# EAGLE design psvsd-v21 (EAGLE 8.2.0)

## Sheet 1 of 2: Connections
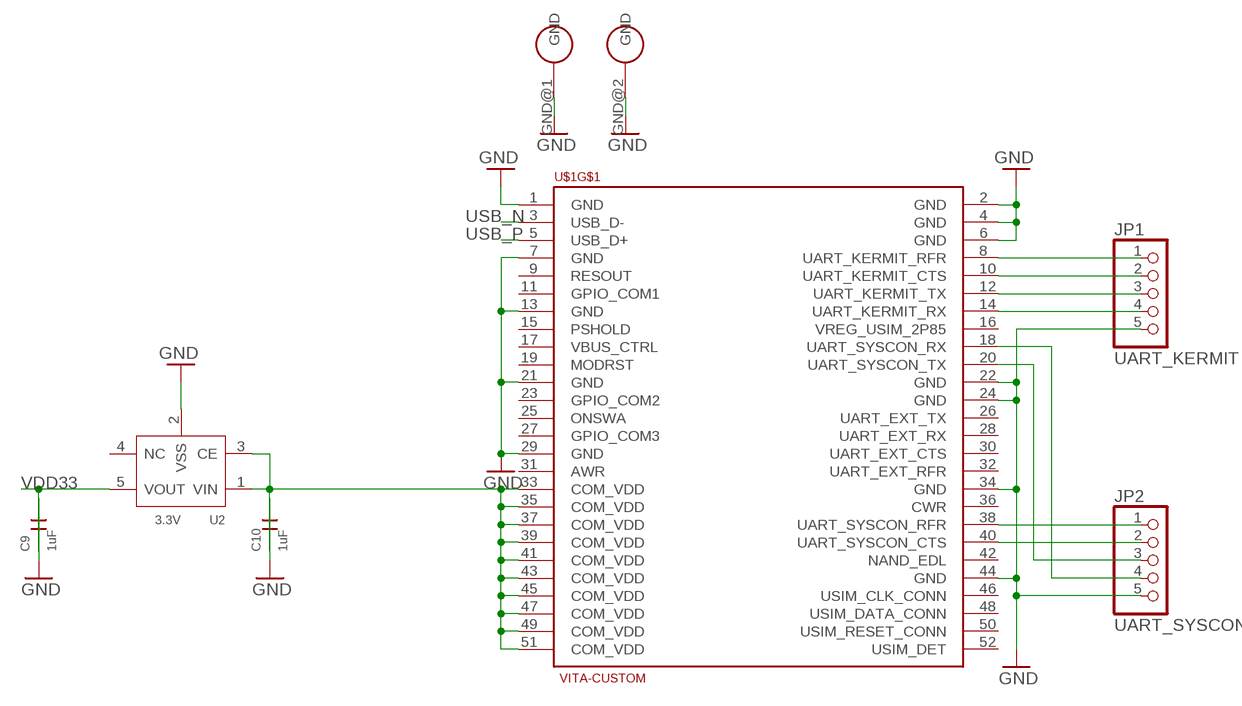
[diagram p0: schematic, sheet 1]

### Parts
C9  1uF  CERAMIC-1NF-50V-5%-C0G(0603)  [C0603]
C10  1uF  CERAMIC-1NF-50V-5%-C0G(0603)  [C0603]
JP1  UART_KERMIT  PINHD-1X5  [1X05]
JP2  UART_SYSCON  PINHD-1X5  [1X05]
U2  3.3V  PMIC-LDO-XC6204B332MR(SOT23-5)  [SOT-23-5]
U$1  VITA-CUSTOM  [VITA-MINI-PCI-E]

### Nets
GND [GND]: C9.2 C10.2 JP1.5 JP2.5 U2.2(VSS) U$1.1(GND) U$1.2(GND) U$1.4(GND) U$1.6(GND) U$1.7(GND) U$1.13(GND) U$1.21(GND) U$1.22(GND) U$1.24(GND) U$1.29(GND) U$1.34(GND) U$1.44(GND) U$1.GND@1(GND) U$1.GND@2(GND) ; also sheet 2
UART_KERMIT_CTS: JP1.2 U$1.10(UART_KERMIT_CTS)
UART_KERMIT_RFR: JP1.1 U$1.8(UART_KERMIT_RFR)
UART_KERMIT_RX: JP1.4 U$1.14(UART_KERMIT_RX)
UART_KERMIT_TX: JP1.3 U$1.12(UART_KERMIT_TX)
UART_SYSCON_CTS: JP2.2 U$1.40(UART_SYSCON_CTS)
UART_SYSCON_RFR: JP2.1 U$1.38(UART_SYSCON_RFR)
UART_SYSCON_RX: JP2.4 U$1.18(UART_SYSCON_RX)
UART_SYSCON_TX: JP2.3 U$1.20(UART_SYSCON_TX)
USB_N [USB]: U$1.3(USB_D-) ; also sheet 2
USB_P [USB]: U$1.5(USB_D+) ; also sheet 2
VDD [Power]: C10.1 U2.1(VIN) U2.3(CE) U$1.33(COM_VDD) U$1.35(COM_VDD) U$1.37(COM_VDD) U$1.39(COM_VDD) U$1.41(COM_VDD) U$1.43(COM_VDD) U$1.45(COM_VDD) U$1.47(COM_VDD) U$1.49(COM_VDD) U$1.51(COM_VDD)
VDD33: C9.1 U2.5(VOUT) ; also sheet 2
Unconnected: U2.4(NC) U$1.9(RESOUT) U$1.11(GPIO_COM1) U$1.15(PSHOLD) U$1.16(VREG_USIM_2P85) U$1.17(VBUS_CTRL) U$1.19(MODRST) U$1.23(GPIO_COM2) U$1.25(ONSWA) U$1.26(UART_EXT_TX) U$1.27(GPIO_COM3) U$1.28(UART_EXT_RX) U$1.30(UART_EXT_CTS) U$1.31(AWR) U$1.32(UART_EXT_RFR) U$1.36(CWR) U$1.42(NAND_EDL) U$1.46(USIM_CLK_CONN) U$1.48(USIM_DATA_CONN) U$1.50(USIM_RESET_CONN) U$1.52(USIM_DET)

## Sheet 2 of 2: USB to SD
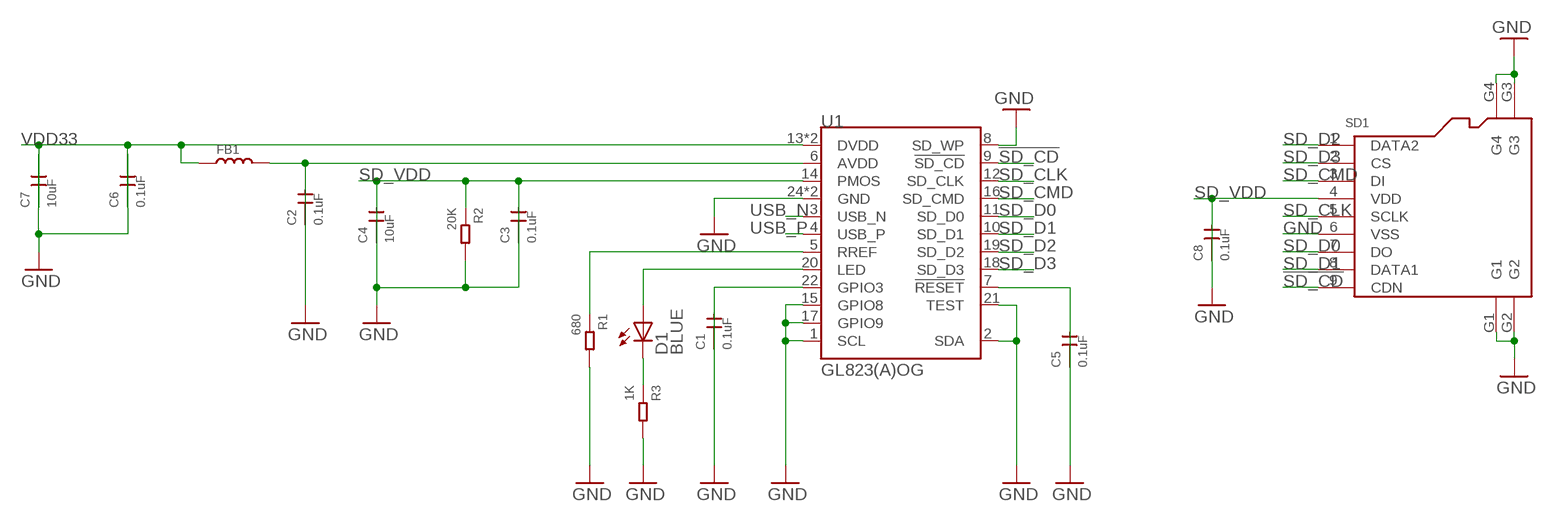
[diagram p1: schematic, sheet 2]

### Parts
C1  0.1uF  CERAMIC-1NF-50V-5%-C0G(0603)  [C0603]
C2  0.1uF  CERAMIC-1NF-50V-5%-C0G(0603)  [C0603]
C3  0.1uF  CERAMIC-1NF-50V-5%-C0G(0603)  [C0603]
C4  10uF  CERAMIC-1NF-50V-5%-C0G(0603)  [C0603]
C5  0.1uF  CERAMIC-1NF-50V-5%-C0G(0603)  [C0603]
C6  0.1uF  CERAMIC-1NF-50V-5%-C0G(0603)  [C0603]
C7  10uF  CERAMIC-1NF-50V-5%-C0G(0603)  [C0603]
C8  0.1uF  CERAMIC-1NF-50V-5%-C0G(0603)  [C0603]
D1  BLUE  LEDCHIP-LED0603  [CHIP-LED0603]
FB1  SMD-FERRITE-BEAD-2500R-50MA(0603)  [L0603]
R1  680  SMD-RES-0R-5%-1/10W(0603)  [R0603]
R2  20K  SMD-RES-0R-5%-1/10W(0603)  [R0603]
R3  1K  SMD-RES-0R-5%-1/10W(0603)  [R0603]
SD1  MICRO-SD-CARD-SOCKET-9P(ST-TF-003A)  [MICRO-SD9+4P-SMD-16.1X14.5X1.85MM]
U1  GL823(A)OG  [QFN-24]

### Nets
!RESET: C5.1 U1.7(!RESET)
!SD_CD: SD1.9(CDN) U1.9(!SD_CD)
AVDD33: C2.1 FB1.2 U1.6(AVDD)
GND [GND]: C1.2 C2.2 C3.2 C4.2 C5.2 C6.2 C7.2 C8.2 R1.2 R2.2 R3.2 SD1.6(VSS) SD1.G1 SD1.G2 SD1.G3 SD1.G4 U1.1(SCL) U1.2(SDA) U1.8(SD_WP) U1.15(GPIO8) U1.17(GPIO9) U1.21(TEST) U1.24(GND) U1.25(GND) ; also sheet 1
GPIO3: C1.1 U1.22(GPIO3)
LED [GND]: D1.A U1.20(LED)
LED_N [GND]: D1.C R3.1
RREF: R1.1 U1.5(RREF)
SD_CLK [Clock/HS]: SD1.5(SCLK) U1.12(SD_CLK)
SD_CMD: SD1.3(DI) U1.16(SD_CMD)
SD_D0 [Clock/HS]: SD1.7(DO) U1.11(SD_D0)
SD_D1 [Clock/HS]: SD1.8(DATA1) U1.10(SD_D1)
SD_D2 [Clock/HS]: SD1.1(DATA2) U1.19(SD_D2)
SD_D3 [Clock/HS]: SD1.2(CS) U1.18(SD_D3)
SD_VDD: C3.1 C4.1 C8.1 R2.1 SD1.4(VDD) U1.14(PMOS)
USB_N [USB]: U1.3(USB_N) ; also sheet 1
USB_P [USB]: U1.4(USB_P) ; also sheet 1
VDD33: C6.1 C7.1 FB1.1 U1.13(DVDD) U1.23(DVDD) ; also sheet 1

## Library data of the parts
C1-C10 = Seeed-Capacitor:CERAMIC-1NF-50V-5%-C0G(0603): 302010341; MPN: GRM1885C1H102JA01D; VALUE: 1nf
D1 = led:LED: LED OSRAM: - CHIPLED LG R971, LG N971, LY N971, LG Q971, LY Q971, LO R971, LY R971 LH N974, LH R974 LS Q976, LO Q976, LY Q976 LO Q996 - Hyper CHIPLED LW Q18S LB Q993, LB Q99A, LB R99A - SideLED LS A670, LO A670, LY A670, LG A670, LP A670 LB A673, LV A673, LT A673, LW A673 LH A674 LY A675 LS A676, LA A676, LO A676, LY A676, LW A676 LS A679, LY A679, LG A679 - Hyper Micro SIDELED® LS Y876, LA Y876, LO Y876, LY Y876 LT Y87S - SmartLED LW L88C, LW L88S LB L89C, LB L89S, LG L890 LS L89K, LO L89K, LY L89K LS L896, LA L896, LO L896, LY L896 - TOPLED LS T670, LO T670, LY T670, LG T670, LP T670 LSG T670, LSP T670, LSY T670, LOP T670, LYG T670 LG T671, LOG T671, LSG T671 LB T673, LV T673, LT T673, LW T673 LH T674 LS T676, LA T676, LO T676, LY T676, LB T676, LH T676, LSB T676, LW T676 LB T67C, LV T67C, LT T67C, LS T67K, LO T67K, LY T67K, LW E67C LS E67B, LA E67B, LO E67B, LY E67B, LB E67C, LV E67C, LT E67C LW T67C LS T679, LY T679, LG T679 LS T770, LO T770, LY T770, LG T770, LP T770 LB T773, LV T773, LT T773, LW T773 LH T774 LS E675, LA E675, LY E675, LS T675 LS T776, LA T776, LO T776, LY T776, LB T776 LHGB T686 LT T68C, LB T68C - Hyper Mini TOPLED® LB M676 - Mini TOPLED Santana® LG M470 LS M47K, LO M47K, LY M47K Source: http://www.osram.convergy.de LUXEON: - LUMILED® LXK2-PW12-R00, LXK2-PW12-S00, LXK2-PW14-U00, LXK2-PW14-V00 LXK2-PM12-R00, LXK2-PM12-S00, LXK2-PM14-U00 LXK2-PE12-Q00, LXK2-PE12-R00, LXK2-PE12-S00, LXK2-PE14-T00, LXK2-PE14-U00 LXK2-PB12-K00, LXK2-PB12-L00, LXK2-PB12-M00, LXK2-PB14-N00, LXK2-PB14-P00, LXK2-PB14-Q00 LXK2-PR12-L00, LXK2-PR12-M00, LXK2-PR14-Q00, LXK2-PR14-R00 LXK2-PD12-Q00, LXK2-PD12-R00, LXK2-PD12-S00 LXK2-PH12-R00, LXK2-PH12-S00 LXK2-PL12-P00, LXK2-PL12-Q00, LXK2-PL12-R00 Source: www.luxeon.com KINGBRIGHT: KA-3528ASYC Source: www.kingbright.com
FB1 = Seeed-Inductor:SMD-FERRITE-BEAD-2500R-50MA(0603): 303030020; VALUE: 2500R-50MA
JP1 JP2 = pinhead:PINHD-1X5: PIN HEADER
R1-R3 = Seeed-Resistor:SMD-RES-0R-5%-1/10W(0603): 301010292; MPN: RC0603JR-070RL; VALUE: 0R
SD1 = Seeed-Connector:MICRO-SD-CARD-SOCKET-9P(ST-TF-003A): 320090000; MPN: ST-TF-003A; VALUE: ST-TF-003A
U1 = GL823:GL823(A): USB 2.0 SD/MMC Card Reader Controller (3.3V)
U2 = Seeed-IC:PMIC-LDO-XC6204B332MR(SOT23-5): 310030046; MPN: XC6204B332MR; VALUE: XC6204B332MR-SOT23-5
U$1 = mini-pci-e:VITA-CUSTOM: Vita specific half Mini PCI Express module.

## Net classes
0 Digital: width 0.305 mm
2 Clock/HS: width 0.305 mm
3 Power: width 0.61 mm
4 USB: width 0.305 mm, clearance 0.508 mm to class 0, clearance 0.508 mm to class 1, clearance 1.27 mm to class 2, clearance 0.508 mm to class 3

## Board
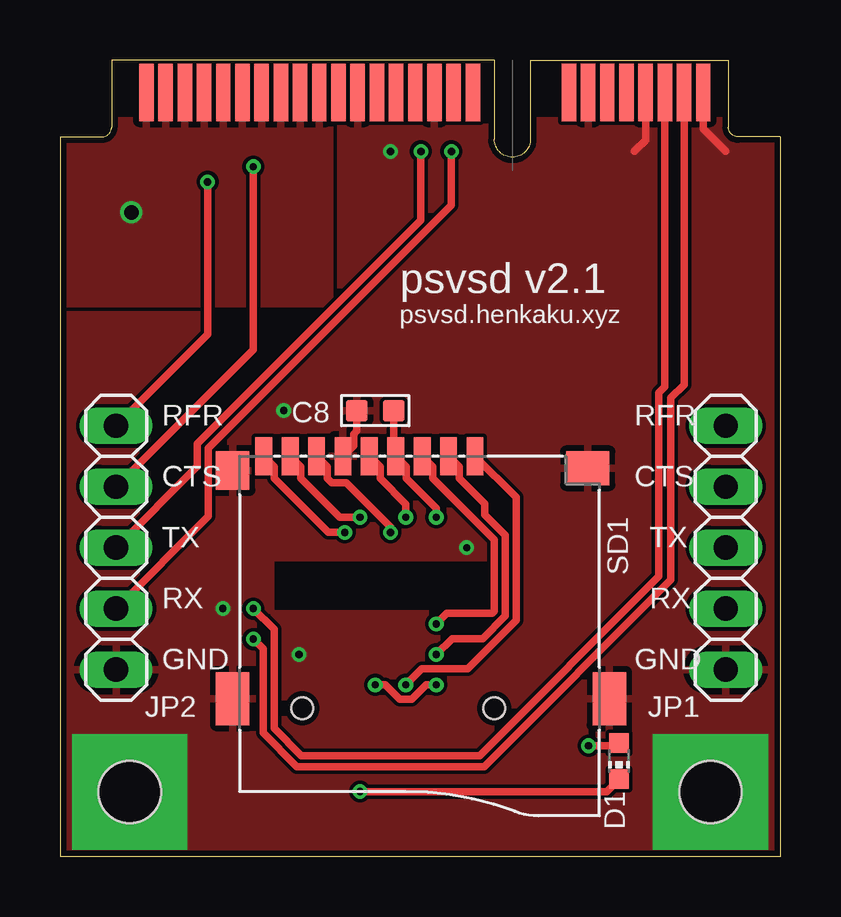
[diagram p2: board, top side]
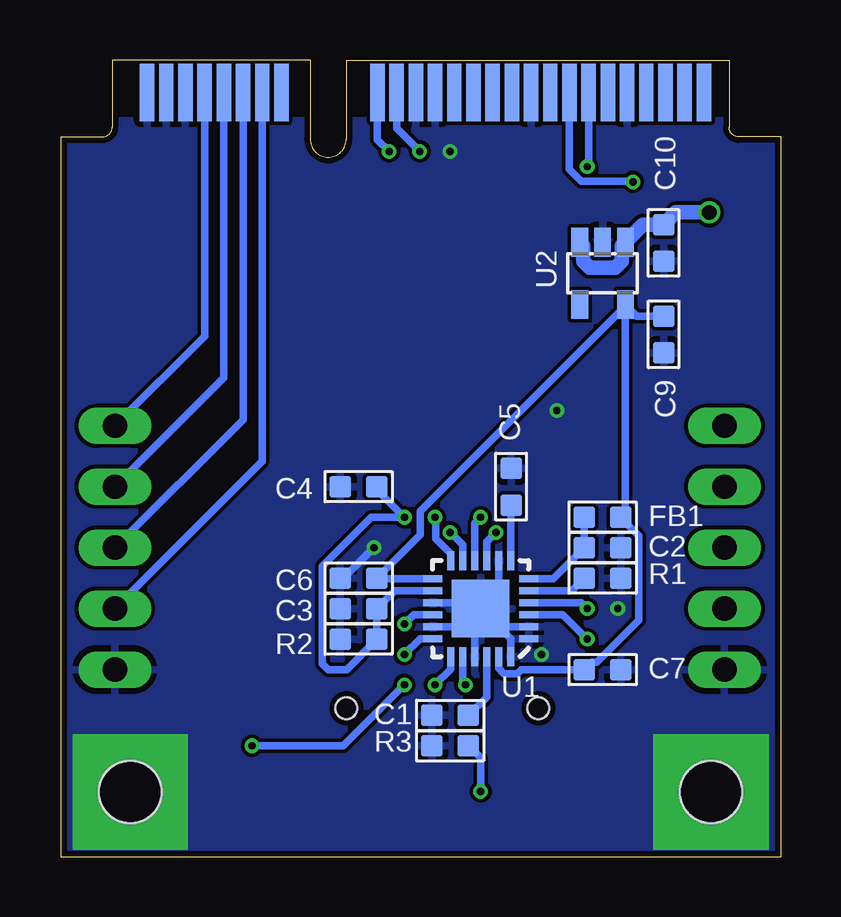
[diagram p3: board, bottom side, seen from below]

Size 30 x 33.2 mm. Coordinates in mm from the lower left corner, seen from the top.
Copper layers (1*16): Top 0.035mm / dielectric 1.5mm / Bottom 0.035mm
Design rules "SeeedStudio_2layer_DRU_no_angle_20140221": minimum track width 6mil, minimum drill 12mil, track to track 6mil, track to pad 6mil, pad to pad 6mil, via to via 6mil, smd to smd 0mil, copper to edge 10mil, drill to drill 10mil, minimum pad ring 10mil, minimum via ring 6mil, stop-mask expansion 2mil, vias tented up to drill 100mil, thermal gap 10mil

### Footprints (pad centres in the part's own frame; a part is rotated, then mirrored left to right if it is on the bottom)
C0603 = smd 0.889 x 0.889: 1 0,0.762; 2 0,-0.762
CHIP-LED0603 = smd 0.8 x 0.8: A 0,-0.75; C 0,0.75
L0603 = smd 0.889 x 0.889: 1 -0.762,0; 2 0.762,0
1X05 = drill 1.016 long: 1 -5.08,0; 2 -2.54,0; 3 0,0; 4 2.54,0; 5 5.08,0
R0603 = smd 0.889 x 0.889: 1 0,0.762; 2 0,-0.762
MICRO-SD9+4P-SMD-16.1X14.5X1.85MM = smd 1.6 x 0.7: 1 0,2.25; 2 0,1.15; 3 0,0.05; 4 0,-1.05; 5 0,-2.15; 6 0,-3.25; 7 0,-4.35; 8 0,-5.45; 9 0,-6.55 | smd 1.6 x 1.4: G1 0.6,-7.85 | smd 2.2 x 1.4: G2 10.1,-7.85; G3 10.1,7.85 | smd 1.4 x 1.8: G4 0.5,6.95 | hole 0.9: 10.5,-4.95; 10.5,3.05
QFN-24 = smd 0.8 x 0.3: 1 -2,1.25; 2 -2,0.75; 3 -2,0.25; 4 -2,-0.25; 5 -2,-0.75; 6 -2,-1.25; 13 2,-1.25; 14 2,-0.75; 15 2,-0.25; 16 2,0.25; 17 2,0.75; 18 2,1.25 | smd 0.3 x 0.8: 7 -1.25,-2; 8 -0.75,-2; 9 -0.25,-2; 10 0.25,-2; 11 0.75,-2; 12 1.25,-2; 19 1.25,2; 20 0.75,2; 21 0.25,2; 22 -0.25,2; 23 -0.75,2; 24 -1.25,2 | smd 2.4 x 2.4: 25 0,0
SOT-23-5 = smd 0.69 x 1.2: 1 -0.95,-1.3; 2 0,-1.3; 3 0.95,-1.3; 4 0.95,1.3; 5 -0.95,1.3
VITA-MINI-PCI-E = smd 0.6 x 2.4: 1 -7.95,1.35; 3 -7.15,1.35; 5 -6.35,1.35; 7 -5.55,1.35; 9 -4.75,1.35; 11 -3.95,1.35; 13 -3.15,1.35; 15 -2.35,1.35; 17 1.65,1.35; 19 2.45,1.35; 21 3.25,1.35; 23 4.05,1.35; 25 4.85,1.35; 27 5.65,1.35; 29 6.45,1.35; 31 7.25,1.35; 33 8.05,1.35; 35 8.85,1.35; 37 9.65,1.35; 39 10.45,1.35; 41 11.25,1.35; 43 12.05,1.35; 45 12.85,1.35; 47 13.65,1.35; 49 14.45,1.35; 51 15.25,1.35 | smd 0.6 x 2.4 bottom: 2 -7.55,1.35; 4 -6.75,1.35; 6 -5.95,1.35; 8 -5.15,1.35; 10 -4.35,1.35; 12 -3.55,1.35; 14 -2.75,1.35; 16 -1.95,1.35; 18 2.05,1.35; 20 2.85,1.35; 22 3.65,1.35; 24 4.45,1.35; 26 5.25,1.35; 28 6.05,1.35; 30 6.85,1.35; 32 7.65,1.35; 34 8.45,1.35; 36 9.25,1.35; 38 10.05,1.35; 40 10.85,1.35; 42 11.65,1.35; 44 12.45,1.35; 46 13.25,1.35; 48 14.05,1.35; 50 14.85,1.35; 52 15.65,1.35 | drill 2.6 pad 4.8 square: GND@1 -8.25,30.5; GND@2 15.95,30.5 | hole 2.6: -8.25,30.5; 15.95,30.5

### Placement (x,y rotation side)
C1  13.77,5.9 270 bottom
C2  7.42,12.88 90 bottom
C3  17.58,10.34 270 bottom
C4  17.58,15.42 270 bottom
C5  11.23,15.42 180 bottom
C6  17.58,11.61 270 bottom
C7  7.42,7.8 90 bottom
C8  13.14,18.6 270 top
C9  4.88,21.77 0 bottom
C10  4.88,25.58 0 bottom
D1  23.3,3.99 180 top
FB1  7.42,14.15 180 bottom
JP1  27.74,12.88 270 top
JP2  2.34,12.88 270 top
R1  7.42,11.61 90 bottom
R2  17.58,9.07 270 bottom
R3  13.77,4.63 270 bottom
SD1  15.04,16.69 270 top
U1  12.5,10.34 180 bottom
U2  7.42,24.31 180 bottom
U$1  18.85,33.2 180 top

### Tracks (layer width: path | path; a pad name or v marks a point on that pad's centre or on a via)
!RESET
  Bottom 0.305: U1.7 11.25,14.64 C5.1
!SD_CD  (via drill 0.3)
  Top 0.305: SD1.9 8.94,16.25 8.94,15.76 11.18,13.52 v11.87,13.52
  Bottom 0.305: U1.9 12.25,13.13 v11.87,13.52
AVDD33
  Bottom 0.305: U1.6 9.47,11.59 C2.1 FB1.2
GND  (via drill 0.3)
  Top 0.305: SD1.6 12.24,17.14 12.24,17.62 12.37,17.75 C8.2 | U$1.7 24.4,29.86 23.93,29.39 | U$1.1 26.8,30.33 27.74,29.39
  Bottom 0.305: U1.8 11.75,11.09 U1.25 | U1.15 12.75,10.59 U1.25 | U1.17 13.25,9.59 13.14,9.71 | 13.14,9.71 U1.25 | U1.21 12.75,9.32 13.14,9.71 | U1.2 11.75,9.59 U1.25 | U1.24 11.25,9.09 U1.25 | C6.2 18.21,11.61 v16.95,12.88
  other vias: 9.96,8.44 6.79,10.34 9.33,18.6 13.77,29.39
  pour Top (rank 3): -0.2,30.66 30.28,30.66 30.28,-1.09 -0.2,-1.09
  pour Bottom (rank 3): -0.2,30.66 30.28,30.66 30.28,-1.09 -0.2,-1.09
GPIO3
  Bottom 0.305: U1.22 12.25,6.65 C1.1
LED  (via drill 0.3)
  Top 0.305: v13.14,7.17 13.54,7.17 14.15,6.56 14.66,6.56 15.27,7.17 v15.68,7.17 | v22.03,4.63 23.18,4.63 D1.A
  Bottom 0.305: U1.20 13.25,7.28 v13.14,7.17 | v15.68,7.17 18.21,4.63 v22.03,4.63
LED_N  (via drill 0.3)
  Top 0.305: v12.5,2.72 22.78,2.72 D1.C
  Bottom 0.305: v12.5,2.72 12.5,4.12 R3.1
RREF
  Bottom 0.305: U1.5 8.7,11.09 R1.1
SD_CLK  (via drill 0.3)
  Top 0.305: SD1.5 13.34,16.25 13.34,15.76 14.41,14.69 v14.41,14.15
  Bottom 0.305: v14.41,14.15 14.38,14.13 14.38,13.26 13.75,12.63 U1.12
SD_CMD  (via drill 0.3)
  Top 0.305: SD1.3 15.54,16.25 15.54,15.76 18.09,13.21 18.09,10.23 18,10.14 16.11,10.14 v15.68,9.71
  Bottom 0.305: U1.16 15.29,10.09 v15.68,9.71
SD_D0  (via drill 0.3)
  Top 0.305: SD1.7 11.14,16.25 11.14,15.76 11.31,15.59 11.93,15.59 13.77,13.74 v13.77,13.52
  Bottom 0.305: U1.11 13.25,13 v13.77,13.52
SD_D1  (via drill 0.3)
  Top 0.305: SD1.8 10.04,16.25 10.04,15.76 11.65,14.15 v12.5,14.15
  Bottom 0.305: U1.10 12.75,13.9 v12.5,14.15
SD_D2  (via drill 0.3)
  Top 0.305: v14.41,7.17 15.07,7.83 16.98,7.83 19.01,9.85 19.01,13.21 | 19.01,13.21 | 19.01,13.21 19.01,14.97 SD1.1
  Bottom 0.305: U1.19 13.75,7.82 v14.41,7.17
SD_D3  (via drill 0.3)
  Top 0.305: v15.68,8.44 16.34,9.1 17.61,9.1 18.55,10.04 18.55,13.4 17.69,14.26 17.69,14.71 16.64,15.76 16.64,16.25 SD1.2
  Bottom 0.305: U1.18 15.02,9.09 v15.68,8.44
SD_VDD  (via drill 0.3)
  Top 0.305: v15.68,14.15 15.68,14.52 14.44,15.76 14.44,16.25 SD1.4 13.9,16.78 C8.1
  Bottom 0.305: U1.14 16.07,11.09 C3.1 R2.1 18.09,7.8 18.85,7.8 19.09,8.04 19.09,12.12 17.06,14.15 v15.68,14.15 16.82,15.29 C4.1
UART_KERMIT_CTS
  Bottom 0.305: JP1.2 23.2,19.96 U$1.10
UART_KERMIT_RFR
  Bottom 0.305: JP1.1 24,21.7 U$1.8
UART_KERMIT_RX
  Bottom 0.305: JP1.4 21.6,16.48 U$1.14
UART_KERMIT_TX
  Bottom 0.305: JP1.3 22.4,18.22 U$1.12
UART_SYSCON_CTS  (via drill 0.3)
  Top 0.305: JP2.2 8.06,21.14 v8.06,28.76
  Bottom 0.305: v8.06,28.76 8,28.81 U$1.40
UART_SYSCON_RFR  (via drill 0.3)
  Top 0.305: JP2.1 6.15,21.77 v6.15,28.12
  Bottom 0.305: v6.15,28.12 6.18,28.15 8.31,28.15 8.8,28.64 U$1.38
UART_SYSCON_RX  (via drill 0.3)
  Top 0.305: JP2.4 6.19,14.19 6.19,17.02 16.31,27.14 v16.31,29.39
  Bottom 0.305: v16.31,29.39 16.8,29.88 U$1.18
UART_SYSCON_TX  (via drill 0.3)
  Top 0.305: JP2.3 5.73,16.27 5.73,17.21 15.04,26.52 v15.04,29.39
  Bottom 0.305: v15.04,29.39 16,30.35 U$1.20
USB_N  (via drill 0.3)
  Top 0.305: U$1.3 26,19.67 25.45,19.13 25.45,11.54 17.68,3.76 9.87,3.76 8.46,5.17 8.46,8.66 v8.06,9.07
  Bottom 0.305: U1.3 9.08,10.09 v8.06,9.07
USB_P  (via drill 0.3)
  Top 0.305: U$1.5 25.2,19.59 24.95,19.34 24.95,11.68 17.48,4.22 10.06,4.22 8.92,5.36 8.92,9.48 v8.06,10.34
  Bottom 0.305: U1.4 8.31,10.59 v8.06,10.34
VDD  (via drill 0.61)
  Bottom 0.61: U2.3 8.22,25.46 8.22,24.82 7.95,24.55 6.89,24.55 6.62,24.82 6.62,25.46 U2.1 5.74,26.34 C10.1 4.37,26.85 v2.98,26.85
  pour Top (rank 2): -0.2,30.66 -0.2,23.04 11.23,23.04 11.23,30.66
VDD33
  Bottom 0.305: C9.1 5.99,22.53 U2.5 | U2.5 6.47,14.34 FB1.1 6.66,14.14 5.91,13.39 5.91,9.85 7.66,8.11 7.88,8.11 C7.1 10.81,7.8 10.97,7.64 11.53,7.64 11.75,7.86 U1.23 | U2.5 6.47,22.95 15.02,14.4 15.02,13.41 C6.1 16.8,11.59 U1.13

### Text on the board
tPlace: psvsd v2.1 | psvsd.henkaku.xyz | RFR | RFR | CTS | CTS | TX | TX | RX | RX | GND | GND